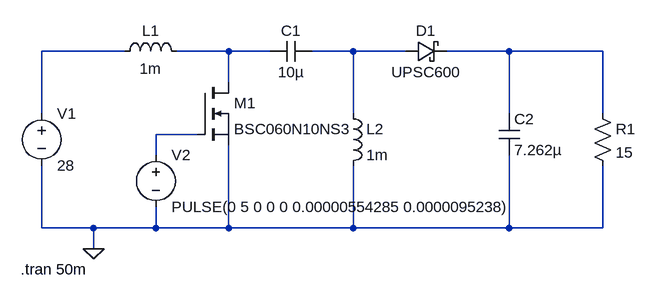
[diagram p0: schematic sepic_circuit.asc]
sepic_circuit.asc, the LTspice schematic file:
Version 4
SHEET 1 880 680
WIRE -48 16 -176 16
WIRE 112 16 32 16
WIRE 176 16 112 16
WIRE 304 16 240 16
WIRE 384 16 304 16
WIRE 544 16 448 16
WIRE 688 16 544 16
WIRE 112 64 112 16
WIRE -176 112 -176 16
WIRE 304 112 304 16
WIRE 544 112 544 16
WIRE 688 112 688 16
WIRE 64 144 0 144
WIRE 0 176 0 144
WIRE -176 288 -176 192
WIRE -96 288 -176 288
WIRE 0 288 0 256
WIRE 0 288 -96 288
WIRE 112 288 112 160
WIRE 112 288 0 288
WIRE 304 288 304 192
WIRE 304 288 112 288
WIRE 544 288 544 176
WIRE 544 288 304 288
WIRE 688 288 688 192
WIRE 688 288 544 288
WIRE -96 320 -96 288
FLAG -96 320 0
SYMBOL voltage -176 96 R0
WINDOW 123 0 0 Left 0
WINDOW 39 0 0 Left 0
SYMATTR InstName V1
SYMATTR Value 28
SYMBOL ind -64 32 R270
WINDOW 0 32 56 VTop 2
WINDOW 3 5 56 VBottom 2
SYMATTR InstName L1
SYMATTR Value 1m
SYMBOL cap 528 112 R0
SYMATTR InstName C2
SYMATTR Value 7.262µ
SYMBOL res 672 96 R0
SYMATTR InstName R1
SYMATTR Value 15
SYMBOL voltage 0 160 R0
WINDOW 123 0 0 Left 0
WINDOW 39 0 0 Left 0
SYMATTR InstName V2
SYMATTR Value PULSE(0 5 0 0 0 0.00000554285 0.0000095238)
SYMBOL schottky 384 32 R270
WINDOW 0 32 32 VTop 2
WINDOW 3 0 32 VBottom 2
SYMATTR InstName D1
SYMATTR Value UPSC600
SYMATTR Description Diode
SYMATTR Type diode
SYMBOL nmos 64 64 R0
SYMATTR InstName M1
SYMATTR Value BSC060N10NS3
SYMBOL cap 240 0 R90
WINDOW 0 0 32 VBottom 2
WINDOW 3 32 32 VTop 2
SYMATTR InstName C1
SYMATTR Value 10µ
SYMBOL ind 288 96 R0
SYMATTR InstName L2
SYMATTR Value 1m
TEXT -208 352 Left 2 !.tran 50m

The netlist it stands for:
* sepic_circuit.asc
V1 N001 0 28
L1 N001 N002 1m
C2 N004 0 7.262µ
R1 N004 0 15
V2 N005 0 PULSE(0 5 0 0 0 0.00000554285 0.0000095238)
D1 N003 N004 UPSC600
M1 N002 N005 0 0 BSC060N10NS3
C1 N003 N002 10µ
L2 N003 0 1m
.model D D
.lib standard.dio
.model NMOS NMOS
.model PMOS PMOS
.lib standard.mos
.tran 50m
.backanno
.end